# EAGLE design sht (EAGLE 9.3.0)
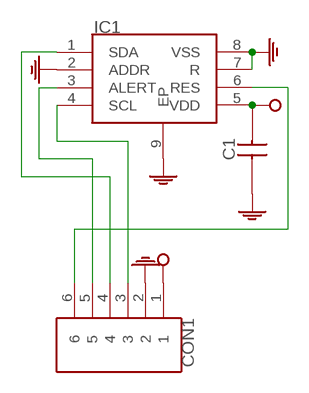
[diagram p0: schematic, sheet 1]

## Parts
C1  CAPACITOR-0603  [0603]
CON1  HEADER-6P-DIP-2_54MM  [HEADER-6P-DIP-2_54MM]
IC1  SHT3X-DIS  [SHT3X-DIS]

## Nets
GND: C1.1 CON1.2 IC1.2(ADDR) IC1.7(R) IC1.8(VSS) IC1.9(EP)
N$1: CON1.6 IC1.6(RES)
N$2: CON1.4 IC1.1(SDA)
N$3: CON1.3 IC1.4(SCL)
N$5: CON1.5 IC1.3(ALERT)
VCC: C1.2 CON1.1 IC1.5(VDD)

## Library data of the parts
C1 = myparts:CAPACITOR-0603
CON1 = myparts:HEADER-6P-DIP-2_54MM
IC1 = myparts:SHT3X-DIS

## Board
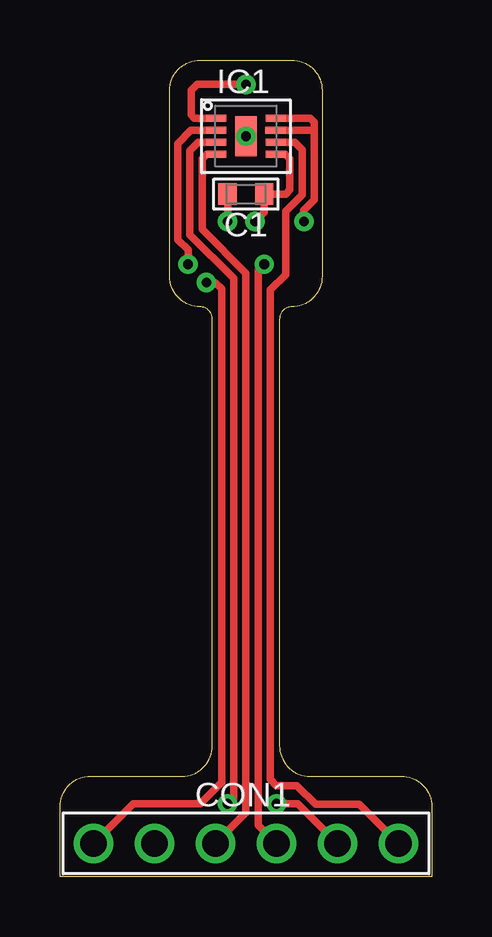
[diagram p1: board, top side]
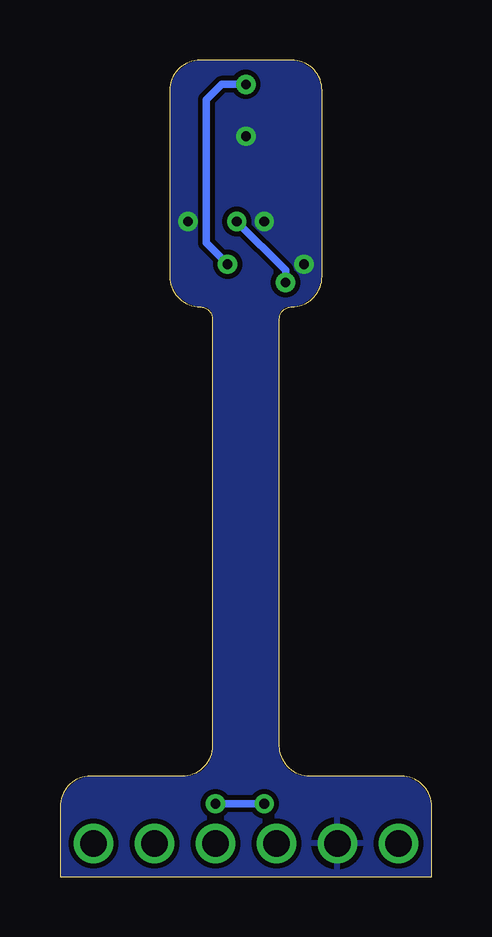
[diagram p2: board, bottom side, seen from below]

Size 15.49 x 34.04 mm. Coordinates in mm from the lower left corner, seen from the top.
Outline: 15.49,0 0,0 0,2.92 arc-90 1.27,4.19 5.08,4.19 arc90 6.35,5.46 6.35,23.24 arc90 5.84,23.75 arc-90 4.57,25.02 4.57,32.77 arc-90 5.84,34.04 9.65,34.04 arc-90 10.92,32.77 10.92,25.02 arc-90 9.65,23.75 arc90 9.14,23.24 9.14,5.46 arc90 10.41,4.19 14.22,4.19 arc-90 15.49,2.92 15.49,0
Copper layers (1*16): Top 0.035mm / dielectric 1.5mm / Bottom 0.035mm
Design rules "myparts": minimum track width 12mil, minimum drill 0.4mm, track to track 8mil, track to pad 8mil, pad to pad 8mil, via to via 8mil, smd to smd 0mil, copper to edge 0mil, drill to drill 6mil, minimum pad ring 10mil, minimum via ring 8mil, stop-mask expansion 4mil, vias tented up to drill 25mil, thermal gap 10mil

### Footprints (pad centres in the part's own frame; a part is rotated, then mirrored left to right if it is on the bottom)
0603 = smd 0.762 x 0.889: 1 -0.762,0; 2 0.762,0
HEADER-6P-DIP-2_54MM = drill 1.1 pad 1.65: 1 0,0; 2 2.54,0; 3 5.08,0; 4 7.62,0; 5 10.16,0; 6 12.7,0
SHT3X-DIS = smd 0.826 x 0.305: 1 -1.238,0.75; 2 -1.238,0.25; 3 -1.238,-0.25; 4 -1.238,-0.75; 5 1.238,-0.75; 6 1.238,-0.25; 8 1.238,0.75 | smd 0.851 x 0.305: 7 1.238,0.25 | smd 0.889 x 1.651: 9 0,0

### Placement (x,y rotation side)
C1  7.75,28.45 0 top
CON1  1.4,1.4 0 top
IC1  7.75,30.86 0 top

### Tracks (layer width: path | path; a pad name or v marks a point on that pad's centre or on a via)
GND  (via drill 0.4)
  Top 0.305: IC1.2 5.46,31.11 4.9,30.56 4.9,26.55 5.33,26.12 v5.33,25.53 | v6.99,27.3 C1.1 | IC1.8 10.43,31.61 10.59,31.45 10.59,31.11 | v10.16,27.3 10.16,27.77 10.59,28.2 10.59,31.11 | IC1.7 10.59,31.11
  other vias: 7.75,30.86
  pour Bottom: 0.13,0.13 0.13,2.79 arc-90 1.4,4.06 5.21,4.06 arc90 6.48,5.33 6.48,23.37 arc90 5.97,23.88 arc-90 4.7,25.15 4.7,32.64 arc-90 5.97,33.91 9.53,33.91 arc-90 10.79,32.64 10.79,25.15 arc-90 9.53,23.88 arc90 9.02,23.37 9.02,5.33 arc90 10.29,4.06 14.1,4.06 arc-90 15.37,2.79 15.37,0.13
N$1
  Top 0.305: IC1.6 9.78,30.61 10.08,30.3 10.08,28.41 9.4,27.73 9.4,25.09 8.76,24.45 8.76,4.06 9.02,3.81 9.87,3.81 10.65,3.03 12.47,3.03 CON1.6
N$2  (via drill 0.4)
  Top 0.305: IC1.1 5.6,31.61 5.46,31.75 5.46,32.77 5.71,33.02 v7.75,33.02 | v8.51,25.53 8.26,25.27 8.26,2.16 CON1.4
  Bottom 0.305: v7.75,33.02 8.76,33.02 9.4,32.38 9.4,26.42 v8.51,25.53
N$3
  Top 0.305: IC1.4 6.11,30.11 5.92,29.92 5.92,26.98 7.75,25.15 7.75,2.67 CON1.3
N$5  (via drill 0.4)
  Top 0.305: IC1.3 5.76,30.61 5.41,30.26 5.41,26.76 7.24,24.94 7.24,3.3 v6.99,3.05 | v9.02,3.05 9.91,3.05 CON1.5
  Bottom 0.305: v6.99,3.05 v9.02,3.05
VCC  (via drill 0.4)
  Top 0.305: IC1.5 9.39,30.11 9.58,29.92 9.58,28.63 9.4,28.45 C1.2 8.51,27.69 v8.13,27.3 | v6.1,24.77 6.48,24.77 6.73,24.51 6.73,3.94 5.84,3.05 3.05,3.05 CON1.1
  Bottom 0.305: v8.13,27.3 6.1,25.27 v6.1,24.77